# Altium schematic sheet Power&BAT.SchDoc
size A4; SheetNumber: 2; SheetTotal: 6
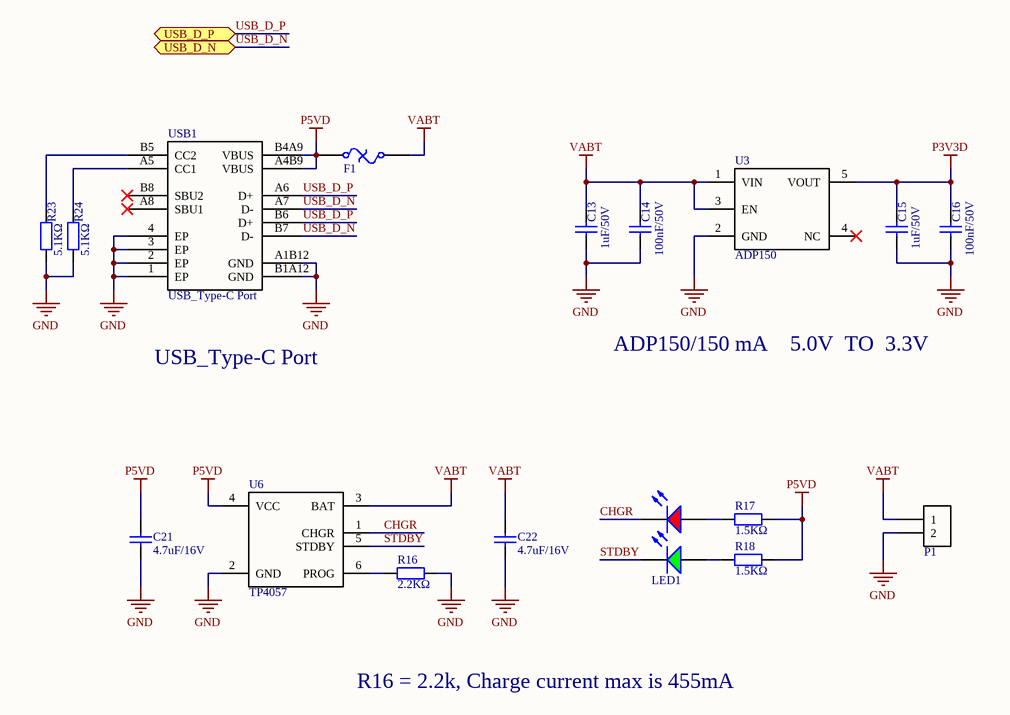
[diagram p0: Power&BAT.SchDoc]

## Parts
C13  1uF/50V  [0603_C]
C14  100nF/50V  [0603_C]
C15  1uF/50V  [0603_C]
C16  100nF/50V  [0603_C]
C21  4.7uF/16V  [0603_C]
C22  4.7uF/16V  [0603_C]
F1  500mA  [F1206]  (value not drawn)
LED1  LTST-C195TGKRKT  [LED_SMD]  (value not drawn)
P1  Header 2  [1.25_SMD]  (value not drawn)
R16  2.2KΩ  [0402_R]
R17  1.5KΩ  [0402_R]
R18  1.5KΩ  [0402_R]
R23  5.1KΩ  [0402_R]
R24  5.1KΩ  [0402_R]
U3  ADP150  [SOT23-5]
U6  TP4057  [SOT23-6]
USB1  USB_Type-C Port  [USB Type C Port (SMD)_16Pin]

## Ports
USB_D_N (bidir), USB_D_P (bidir)

## Nets
GND: C13.1 C14.1 C15.1 C16.1 C21.1 C22.1 P1.2 R16.2 R23.1 R24.1 U3.2(GND) U6.2(GND) USB1.1(EP) USB1.2(EP) USB1.3(EP) USB1.4(EP) USB1.A1B12(GND) USB1.B1A12(GND)
P3V3D: C15.2 C16.2 U3.5(VOUT)
P5VD: C21.2 F1.1 R17.2 R18.2 U6.4(VCC) USB1.A4B9(VBUS) USB1.B4A9(VBUS)
VABT: C13.2 C14.2 C22.2 F1.2 P1.1 U3.1(VIN) U3.3(EN) U6.3(BAT)
CHGR: LED1.4 U6.1(CHGR)
STDBY: LED1.3 U6.5(STDBY)
USB_D_N: USB1.A7(D-) USB1.B7(D-) ; port USB_D_N
USB_D_P: USB1.A6(D+) USB1.B6(D+) ; port USB_D_P
NetLED1_1: LED1.1 R18.1
NetLED1_2: LED1.2 R17.1
NetR16_1: R16.1 U6.6(PROG)
NetR23_2: R23.2 USB1.B5(CC2)
NetR24_2: R24.2 USB1.A5(CC1)

Not connected (* = marked no-connect by the designer): U3 4(NC)*; USB1 A8(SBU1)* B8(SBU2)*

## Notes on the sheet
- USB_Type-C Port
- ADP150/150 mA    5.0V  TO  3.3V
- R16 = 2.2k, Charge current max is 455mA
- Date:
- Size:
- Project Title:
- A4
- Revision:
- Sheet:
- of:
- File:
- Author:
- Chenhui Zhao

## Library data of the parts
C13 C15 = 0603 1uF (105) 10% 50V: 贴片电容; ComponentLink1Description: 供应商链接; ComponentLink1URL: http://www.szlcsc.com/product/details_16531.html; Package: 0603; Supplier: LC; SuppliersPartNumber: C15849
C14 C16 = 0603 100nF (104) 10% 50V: 贴片电容; ComponentLink1Description: 供应商链接; ComponentLink1URL: http://www.szlcsc.com/product/details_15331.html; Package: 0603; Supplier: LC; SuppliersPartNumber: C14663
C21 C22 = 0603 4.7uF (475) 10% 16V: 贴片电容; ComponentLink1Description: 供应商链接; ComponentLink1URL: http://www.szlcsc.com/product/details_20375.html; Package: 0603; Supplier: LC; SuppliersPartNumber: C19666
F1 = Fuse
LED1 = LED_SMD
P1 = Header 2: Header, 2-Pin
R16 = 0402 2.2KΩ (2201) 1%: 贴片电阻; ComponentLink1Description: 供应商链接; ComponentLink1URL: http://www.szlcsc.com/product/details_26622.html; Package: 0402; Supplier: LC; SuppliersPartNumber: C25879
R17 R18 = 0402 1.5KΩ (1501) 1%: 贴片电阻; ComponentLink1Description: 供应商链接; ComponentLink1URL: http://www.szlcsc.com/product/details_26610.html; Package: 0402; Supplier: LC; SuppliersPartNumber: C25867
R23 R24 = 0402 5.1KΩ (5101) 1%: 贴片电阻; ComponentLink1Description: 供应商链接; ComponentLink1URL: http://www.szlcsc.com/product/details_26648.html; Package: 0402; Supplier: LC; SuppliersPartNumber: C25905
U3 = ADP150: Ultralow Noise, 150 mA CMOS Linear Regulator
U6 = TP4057: 500mA线性锂离子电池充电器